# Altium project CurrentSensor_ina219.PrjPcb
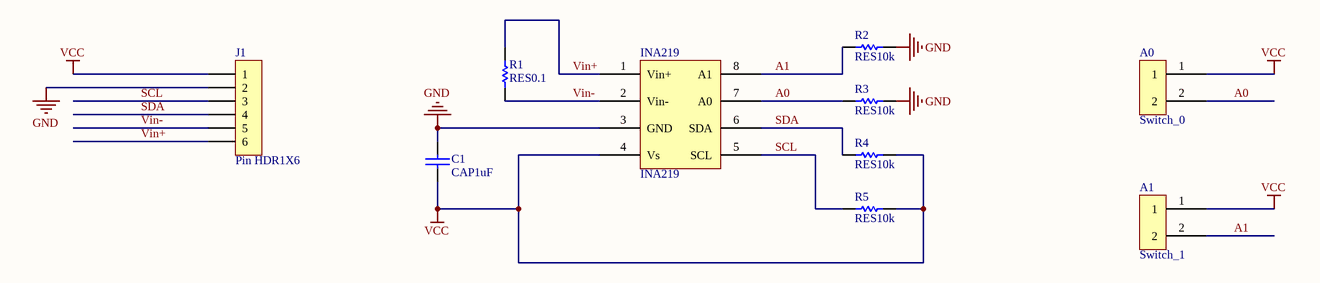
[diagram p0: Current Sensor.SchDoc]
1 sheet, 10 parts. Net scope: global (net labels, ports and power ports of the same name join across sheets).
Board file: Current Sensor.PcbDoc

## Sheet Current Sensor.SchDoc
size A4

### Parts
A0  Switch_0  [TSOP65P180X145-2N]
A1  Switch_1  [TSOP65P180X145-2N]
C1  CAP1uF  [0603C]
INA219  INA219  [INA219]
J1  Pin HDR1X6  [Pin HDR1X6/2.54mm-S]
R1  RES0.1  [2512R]
R2  RES10k  [0603R]
R3  RES10k  [0603R]
R4  RES10k  [0603R]
R5  RES10k  [0603R]

### Nets
GND: C1.2 INA219.3(GND) J1.2 R2.2 R3.2
VCC: A0.1 A1.1 C1.1 INA219.4(Vs) J1.1 R4.2 R5.2
A0: A0.2 INA219.7(A0) R3.1
A1: A1.2 INA219.8(A1) R2.1
SCL: INA219.5(SCL) J1.3 R5.1
SDA: INA219.6(SDA) J1.4 R4.1
Vin+: INA219.1(Vin+) J1.6 R1.1
Vin-: INA219.2(Vin-) J1.5 R1.2

### Library data of the parts
A0 A1 = Component_1
C1 = CAP: 无极性电容
R1-R5 = RES